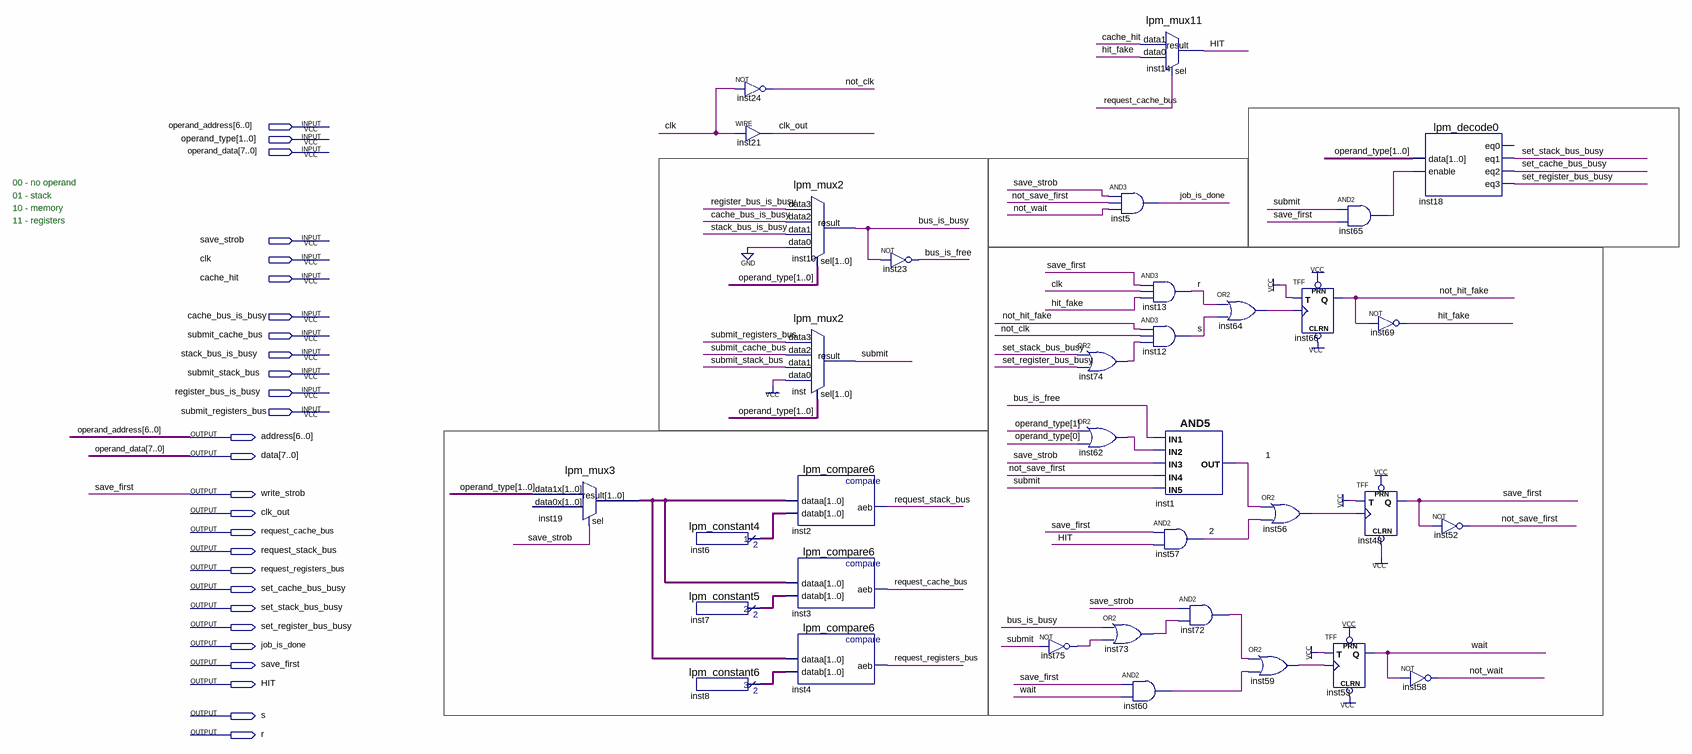
[diagram p0: schematic sheet]
// Quartus schematic DataSaveBlock.bdf as structural Verilog: 35 symbols, 27 pins
module DataSaveBlock (
  input  [6:0] operand_address,
  input  [1:0] operand_type,
  input  [7:0] operand_data,
  input  save_strob,
  input  clk,
  input  cache_hit,
  input  cache_bus_is_busy,
  input  submit_cache_bus,
  input  stack_bus_is_busy,
  input  submit_stack_bus,
  input  register_bus_is_busy,
  input  submit_registers_bus,
  output [6:0] address,
  output [7:0] data,
  output write_strob,
  output clk_out,
  output request_cache_bus,
  output request_stack_bus,
  output request_registers_bus,
  output set_cache_bus_busy,
  output set_stack_bus_busy,
  output set_register_bus_busy,
  output job_is_done,
  output save_first,
  output HIT,
  output s,
  output r
);

  wire \1 , \2 , bus_is_busy, bus_is_free, hit_fake, inst56_out, inst59_out, inst60_out, inst62_out,
       inst64_out, inst65_out, inst72_out, inst73_out, inst74_out, inst75_out, not_clk, not_hit_fake,
       not_save_first, not_wait, submit, \wait ;
  wire [1:0] inst6_result, inst7_result, inst8_result, inst19_result;

  lpm_mux3 inst19 (.data1x(operand_type), .sel(save_strob), .result(inst19_result));  // open: data0x
  lpm_constant4 inst6 (.result(inst6_result));
  lpm_constant5 inst7 (.result(inst7_result));
  lpm_constant6 inst8 (.result(inst8_result));
  not inst24 (not_clk, clk);
  assign clk_out = clk;  // WIRE inst21
  lpm_mux2 inst10 (
    .data3(register_bus_is_busy), .data2(cache_bus_is_busy), .data1(stack_bus_is_busy), .data0(1'b0),
    .sel(operand_type), .result(bus_is_busy));
  lpm_mux2 inst (
    .data3(submit_registers_bus), .data2(submit_cache_bus), .data1(submit_stack_bus), .data0(1'b1),
    .sel(operand_type), .result(submit));
  lpm_compare6 inst2 (.dataa(inst19_result), .datab(inst6_result), .aeb(request_stack_bus));
  lpm_compare6 inst3 (.dataa(inst19_result), .datab(inst7_result), .aeb(request_cache_bus));
  lpm_compare6 inst4 (.dataa(inst19_result), .datab(inst8_result), .aeb(request_registers_bus));
  not inst23 (bus_is_free, bus_is_busy);
  or inst74 (inst74_out, set_stack_bus_busy, set_register_bus_busy);
  or inst62 (inst62_out, operand_type[1], operand_type[0]);
  not inst75 (inst75_out, submit);
  and inst5 (job_is_done, save_strob, not_save_first, not_wait);
  or inst73 (inst73_out, bus_is_busy, inst75_out);
  and inst60 (inst60_out, save_first, \wait );
  lpm_mux11 inst14 (.data1(cache_hit), .data0(hit_fake), .sel(request_cache_bus), .result(HIT));
  and inst13 (r, save_first, clk, hit_fake);
  and inst12 (s, not_hit_fake, not_clk, inst74_out);
  and inst1 (\1 , bus_is_free, inst62_out, save_strob, not_save_first, submit);
  and inst57 (\2 , save_first, HIT);
  and inst72 (inst72_out, save_strob, inst73_out);
  or inst64 (inst64_out, r, s);
  or inst56 (inst56_out, \1 , \2 );
  or inst59 (inst59_out, inst72_out, inst60_out);
  and inst65 (inst65_out, submit, save_first);
  TFF inst66 (.PRN(1'b1), .CLRN(1'b1), .T(1'b1), .CLK(inst64_out), .Q(not_hit_fake));
  TFF inst53 (.PRN(1'b1), .CLRN(1'b1), .T(1'b1), .CLK(inst59_out), .Q(\wait ));
  not inst69 (hit_fake, not_hit_fake);
  TFF inst48 (.PRN(1'b1), .CLRN(1'b1), .T(1'b1), .CLK(inst56_out), .Q(save_first));
  lpm_decode0 inst18 (
    .data(operand_type), .enable(inst65_out), .eq1(set_stack_bus_busy), .eq2(set_cache_bus_busy),
    .eq3(set_register_bus_busy));  // open: eq0
  not inst52 (not_save_first, save_first);
  not inst58 (not_wait, \wait );

  assign address = operand_address;
  assign data = operand_data;
  assign write_strob = save_first;

  // Notes on the sheet:
  //   00 - no operand
  //   01 - stack
  //   10 - memory
  //   11 - registers
endmodule
